# Altium schematic sheet SCH_main.SchDoc
size A4
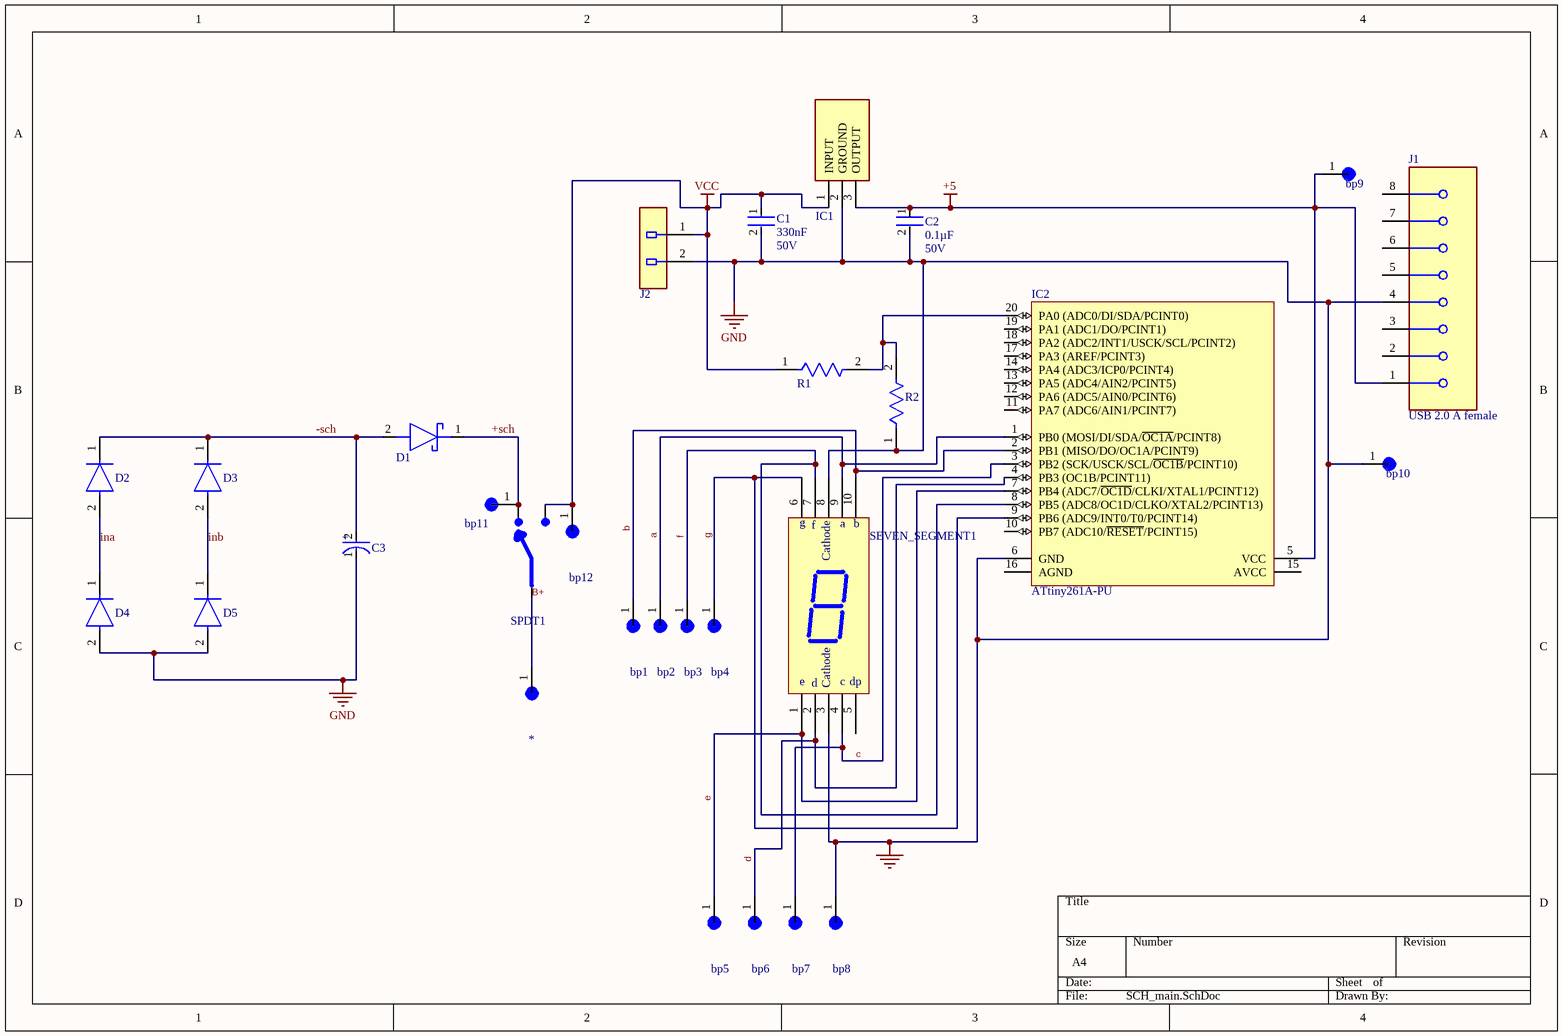
[diagram p0: SCH_main.SchDoc]

## Parts
*  Battery Pad  [Battery pad]  (value not drawn)
bp1  Battery Pad  [Battery pad]  (value not drawn)
bp2  Battery Pad  [Battery pad]  (value not drawn)
bp3  Battery Pad  [Battery pad]  (value not drawn)
bp4  Battery Pad  [Battery pad]  (value not drawn)
bp5  Battery Pad  [Battery pad]  (value not drawn)
bp6  Battery Pad  [Battery pad]  (value not drawn)
bp7  Battery Pad  [Battery pad]  (value not drawn)
bp8  Battery Pad  [Battery pad]  (value not drawn)
bp9  Battery Pad  [Battery pad]  (value not drawn)
bp10  Battery Pad  [Battery pad]  (value not drawn)
bp11  Battery Pad  [Battery pad]  (value not drawn)
bp12  Battery Pad  [Battery pad]  (value not drawn)
C1  Capacitance: 330nF  Voltage: 50V  [Kemet_C322C334M5U5TA7301_0]  (hidden comment: Cap_Kemet_C322C334M5U5TA7301_eec)
C2  Capacitance: 0.1µF  Voltage: 50V  [BC_Components_K104Z15Y5VF5TL2_0]  (hidden comment: Cap_BC_Components_K104Z15Y5VF5TL2_eec)
C3  ECA-1CM471  [Panasonic_ECA-1_0]  (value not drawn)
D1  SD103A-TR  [DIOAD950W60L350D150]  (value not drawn)
D2  Diode_Vishay_1N4007-E3-73_eec  [Vishay_1N4007-E3-73_0]  (value not drawn)
D3  Diode_Vishay_1N4007-E3-73_eec  [Vishay_1N4007-E3-73_0]  (value not drawn)
D4  Diode_Vishay_1N4007-E3-73_eec  [Vishay_1N4007-E3-73_0]  (value not drawn)
D5  Diode_Vishay_1N4007-E3-73_eec  [Vishay_1N4007-E3-73_0]  (value not drawn)
IC1  LM7805CT  [TO254P470X1016X2019-3P]  (value not drawn)
IC2  ATtiny261A-PU  [20P3]
J1  USB 2.0 A female  [usbA2F_Molex_67329-8000_0]
J2  826926-2  [TE_826926-2_0]  (value not drawn)
R1  CFR25J100R  [RESISTOR_Tyco_CFR25J100R_0]  (value not drawn)
R2  CFR25J100R  [RESISTOR_Tyco_CFR25J100R_0]  (value not drawn)
SEVEN_SEGMENT1  CC_SEVEN_SEGMENT  [7SEG-Avago-Broadcam_HDSP-5551_0]  (value not drawn)
SPDT1  spdt_JS202011SCQN  (value not drawn)

## Nets
+5: bp9.1 C2.1 IC1.3(OUTPUT) IC2.5(VCC) J1.1
GND: bp8.1 bp10.1 C1.2 C2.2 C3.1(-) D4.2(A) D5.2(A) IC1.2(GROUND) IC2.6(GND) J1.4 J2.2 R2.1 SEVEN_SEGMENT1.3 SEVEN_SEGMENT1.8
VCC: bp12.1 C1.1 IC1.1(INPUT) J2.1 R1.1 SPDT1.3
+sch: bp11.1 D1.1(K) SPDT1.2
-sch: C3.2(+) D1.2(A) D2.1(C) D3.1(C)
a: bp2.1 IC2.1(PB0_(MOSI/DI/SDA/~{OC1A}/PCINT8)) SEVEN_SEGMENT1.9
b: bp1.1 IC2.2(PB1_(MISO/DO/OC1A/PCINT9)) SEVEN_SEGMENT1.10
B+: *.1
c: bp7.1 IC2.3(PB2_(SCK/USCK/SCL/~{OC1B}/PCINT10)) SEVEN_SEGMENT1.4
d: bp6.1 IC2.4(PB3_(OC1B/PCINT11)) SEVEN_SEGMENT1.2
e: bp5.1 IC2.7(PB4_(ADC7/~{OC1D}/CLKI/XTAL1/PCINT12)) SEVEN_SEGMENT1.1
f: bp3.1 IC2.8(PB5_(ADC8/OC1D/CLKO/XTAL2/PCINT13)) SEVEN_SEGMENT1.7
g: bp4.1 IC2.9(PB6_(ADC9/INT0/T0/PCINT14)) SEVEN_SEGMENT1.6
ina: D2.2(A) D4.1(C)
inb: D3.2(A) D5.1(C)
NetIC2_20: IC2.20(PA0_(ADC0/DI/SDA/PCINT0)) R1.2 R2.2

Not connected (* = marked no-connect by the designer): IC2 10(PB7_(ADC10/~{RESET}/PCINT15)) 11(PA7_(ADC6/AIN1/PCINT7)) 12(PA6_(ADC5/AIN0/PCINT6)) 13(PA5_(ADC4/AIN2/PCINT5)) 14(PA4_(ADC3/ICP0/PCINT4)) 15(AVCC) 16(AGND) 17(PA3_(AREF/PCINT3)) 18(PA2_(ADC2/INT1/USCK/SCL/PCINT2)) 19(PA1_(ADC1/DO/PCINT1)); J1 2 3 5(MNT_1) 6(MNT_2) 7(MNT_3) 8(MNT_4); SEVEN_SEGMENT1 5; SPDT1 1

## Notes on the sheet
- (in symbol CC_SEVEN_SEGMENT) g; f; a; b; Cathode; e; c; dp; d

## Library data of the parts
C1 = Cap_Kemet_C322C334M5U5TA7301_eec: CAP CER 0.33UF 50V Z5U RADIAL; Manufacturer: Kemet; Value: 330nF; Part Number: C322C334M5U5TA7301; helpURL: https://upverter.com/upn/revision/a7e23f606e787d17/; ComponentLink2Description: Datasheet; Temperature: -10°C to +85°C; Package: AXIAL; Supplier 2: Mouser; Price: 0.206679296795; Supplier 1: Digi-Key; ComponentLink1URL: https://upverter.com/upn/revision/a7e23f606e787d17/; Supplier Part Number 2: 80-C322C334M5U-TR; Supplier Part Number 1: 399-9882-1-ND; ComponentLink1Description: Upverter; ComponentLink2URL: http://www.mouser.com/ds/2/212/KEM_C1051_GOLDMAX_Z5U-1140498.pdf; RoHS: TRUE; Mouser Part Number: 80-C322C334M5U-TR; Temperature Range High: +85°C; Digikey Description: CAP CER 0.33UF 50V Z5U RADIAL; Digikey Part Number: 399-9882-1-ND; Lead Free: yes; Temperature Range Low: -10°C
C2 = Cap_BC_Components_K104Z15Y5VF5TL2_eec: CAP CER 0.1UF 50V Y5V RADIAL; Manufacturer: BC Components; Value: 0.1µF; helpURL: https://upverter.com/upn/revision/4dc92cb63de4f5f3/; ComponentLink2Description: Datasheet; Temperature: -30°C to +85°C; Package: RADIAL; Supplier 2: Mouser; Supplier 1: Digi-Key; ComponentLink1URL: https://upverter.com/upn/revision/4dc92cb63de4f5f3/; Supplier Part Number 2: 594-K104Z15Y5VF5TL2; Supplier Part Number 1: BC1160CT-ND; ComponentLink1Description: Upverter; ComponentLink2URL: https://upverter.com/datasheet/c2fb6937a55b84470fe4a5f67c9f6f24ab7ecd76.pdf; RoHS: TRUE; Mouser Part Number: 594-K104Z15Y5VF5TL2; Ipc Land Pattern Name: CAPRD250W70D400H400; Temperature Range High: +85°C; Digikey Description: CAP CER 0.1UF 50V Y5V RADIAL; Digikey Part Number: BC1160CT-ND; Lead Free: yes; Temperature Range Low: -30°C; Part Number: K104Z15Y5VF5TL2
D1 = SD103A-TR: Schottky Diode; Manufacturer_Name: Vishay; Datasheet Link: https://componentsearchengine.com/Datasheets/5/SD103A-TR.pdf; Manufacturer_Part_Number: SD103A-TR; Mouser Part Number: 625-SD103A; Mouser Price/Stock: https://www.mouser.co.uk/ProductDetail/Vishay-Semiconductors/SD103A-TR?qs=RwahMLkpD2urFD%2FzZdGOBw%3D%3D; Arrow Part Number: SD103A-TR; Arrow Price/Stock: https://www.arrow.com/en/products/sd103a-tr/vishay
D2-D5 = Diode_Vishay_1N4007-E3-73_eec: DIODE GEN PURP 1KV 1A DO204AL; Part Number: 1N4007-E3/73; Manufacturer: Vishay; helpURL: https://upverter.com/upn/revision/c7ff6a0a3bd206ca/; ComponentLink2Description: Datasheet; Temperature: -50°C to +150°C; Package: DO-204AL; Supplier 2: Mouser; Price: 0.107260195375; Supplier 1: Digi-Key; ComponentLink1URL: https://upverter.com/upn/revision/c7ff6a0a3bd206ca/; Supplier Part Number 2: 625-1N4007-E3/73; Supplier Part Number 1: 1N4007-E3/73GICT-ND; ComponentLink1Description: Upverter; ComponentLink2URL: http://www.vishay.com/doc?88503; RoHS: TRUE; Mouser Part Number: 625-1N4007-E3/73; Ipc Land Pattern Name: DIOPA775W110L464D237; Temperature Range High: +150°C; Digikey Description: DIODE GEN PURP 1KV 1A DO204AL; Digikey Part Number: 1N4007-E3/73GICT-ND; Lead Free: yes; Temperature Range Low: -50°C
IC1 = LM7805CT: Integrated Circuit; Manufacturer_Name: Texas Instruments; Datasheet Link: http://www.ti.com/lit/ds/symlink/lm340.pdf; Height: 4.7mm; Manufacturer_Part_Number: LM7805CT; Mouser Part Number: 926-LM7805CT; Mouser Price/Stock: https://www.mouser.co.uk/ProductDetail/Texas-Instruments/LM7805CT/?qs=QbsRYf82W3EaqXeMDVwIfQ%3D%3D; Arrow Part Number: LM7805CT; Arrow Price/Stock: https://www.arrow.com/en/products/lm7805ct/texas-instruments
IC2 = ATTINY261A-PU: 8-bit AVR Microcontroller, 1.8-5.5V, 2KB Flash, 128 Bytes EEPROM, 128 Bytes SRAM, 20-pin PDIP, Industrial Grade (-40°C to 85°C), Pb-Free; Code_JEDEC: MS-001-AD; PackageVersion: revC, Jan-2004; PackageReference: 20P3; PackageDescription: 20-lead (0.300"/7.62mm Wide) Plastic Dual Inline Package (PDIP); DatasheetVersion: revB, Jan-2010; PartNumber: ATTINY261A-PU
J1 = 67329-8000
R1 R2 = CFR25J100R: Carbon Film Resistors - Through Hole 100Ohm 1/3W 1200PPM; Manufacturer: TE Connectivity; Tolerance: 5%; Resistance: 100R; Temperature Coefficient: 0ppm/°C; Max Power Dissipation: 333mW; Power Rating: 330mW; Voltage Rating: 250V; Number of Resistors: 1; Supplier 1: Mouser; Manufacturer Part Number: CFR25J100R; RoHS: Yes; Category: Through-Hole Resistors; Stock 1: 3274; Pricing 1: 10000=0.00800 (USD); Mount: Axial; Case/Package: Axial; Min Operating Temperature: -55°C; Max Operating Temperature: 155°C; Termination: Axial; Resistor Type: Thin Film; Packaging: Tape and Reel; Number of Terminations: 2; Series: CFR25, Neohm; Voltage Rating (DC): 250V; Resistance Tolerance: 5%; Technology: CARBON FILM; Diameter: 2.5mm; Length: 6.8mm; RoHS Compliant: Yes; REACH SVHC: No SVHC; ELV: Compliant; ComponentLink1URL: https://datasheet.ciiva.com/11823/0900766b80098b49-11823335.pdf?src-supplier=RSComponents; ComponentLink1Description: https://datasheet.ciiva.com/11823/0900766b80098b49-11823335.pdf?src-supplier=RSComponents; ComponentLink2URL: https://datasheet.ciiva.com/24484/eng-ds-1773195-d-24484279.pdf?src-supplier=Onlinecomponents.com; ComponentLink2Description: https://datasheet.ciiva.com/24484/eng-ds-1773195-d-24484279.pdf?src-supplier=Onlinecomponents.com; ComponentLink3URL: https://datasheet.ciiva.com/22665/1723854-22665052.pdf?src-supplier=Element14; ComponentLink3Description: https://datasheet.ciiva.com/22665/1723854-22665052.pdf?src-supplier=Element14
SPDT1 = spdt_JS202011SCQN: C & K COMPONENTS - JS202011SCQN - SWITCH, DPDT, 0.6A, 6VDC, SMD; Manufacturer: ITT C&K; Actuator Material: Nylon,Polyamide; Max Voltage Rating (DC): 6V; Contact Resistance: 70mR; Max Current Rating: 300mA; Switch Travel: 2mm; Switch Function: On-On; Actuator Type: Standard; Supplier 1: Digi-Key; RoHS: Yes; Category: Slide Switches; Pricing 1: 1=0.55000, 10=0.53000, 25=0.51040, 100=0.44180, 250=0.40252, 500=0.37306 (USD); Mount: Surface Mount; Contact Material: Copper Alloy; Contact Plating: Silver; Housing Material: Nylon; Min Operating Temperature: -20°C; Max Operating Temperature: 85°C; Throw Configuration: DPDT; Termination: Gull Wing; Voltage Rating (DC): 6V; Packaging: Tape and Reel; Contact Current Rating: 300mA; Package Quantity: 1; Current Rating: 300mA; Orientation: Vertical; Length: 9mm; Depth: 7.5mm; Actuator Length: 2mm; Radiation Hardening: No; REACH SVHC: No SVHC; Lead Free: Lead Free; ComponentLink1URL: https://datasheet.ciiva.com/23829/1707718-23829488.pdf?src-supplier=Newark; ComponentLink1Description: https://datasheet.ciiva.com/23829/1707718-23829488.pdf?src-supplier=Newark; ComponentLink2URL: https://datasheet.ciiva.com/2889/js-29aug13-2889127.pdf?src-supplier=Digi-Key; ComponentLink2Description: https://datasheet.ciiva.com/2889/js-29aug13-2889127.pdf?src-supplier=Digi-Key; ComponentLink3URL: https://datasheet.ciiva.com/2889/js-15sept15-2889128.pdf?src-supplier=Digi-Key; ComponentLink3Description: https://datasheet.ciiva.com/2889/js-15sept15-2889128.pdf?src-supplier=Digi-Key; ComponentLink4URL: https://datasheet.ciiva.com/2889/js-15sept15-2889129.pdf?src-supplier=Digi-Key; ComponentLink4Description: https://datasheet.ciiva.com/2889/js-15sept15-2889129.pdf?src-supplier=Digi-Key; ComponentLink5URL: https://datasheet.ciiva.com/22630/1707718-22630697.pdf?src-supplier=Element14; ComponentLink5Description: https://datasheet.ciiva.com/22630/1707718-22630697.pdf?src-supplier=Element14; ComponentLink6URL: https://datasheet.ciiva.com/8625/js-9dec14-8625470.pdf?src-supplier=Avnet; ComponentLink6Description: https://datasheet.ciiva.com/8625/js-9dec14-8625470.pdf?src-supplier=Avnet